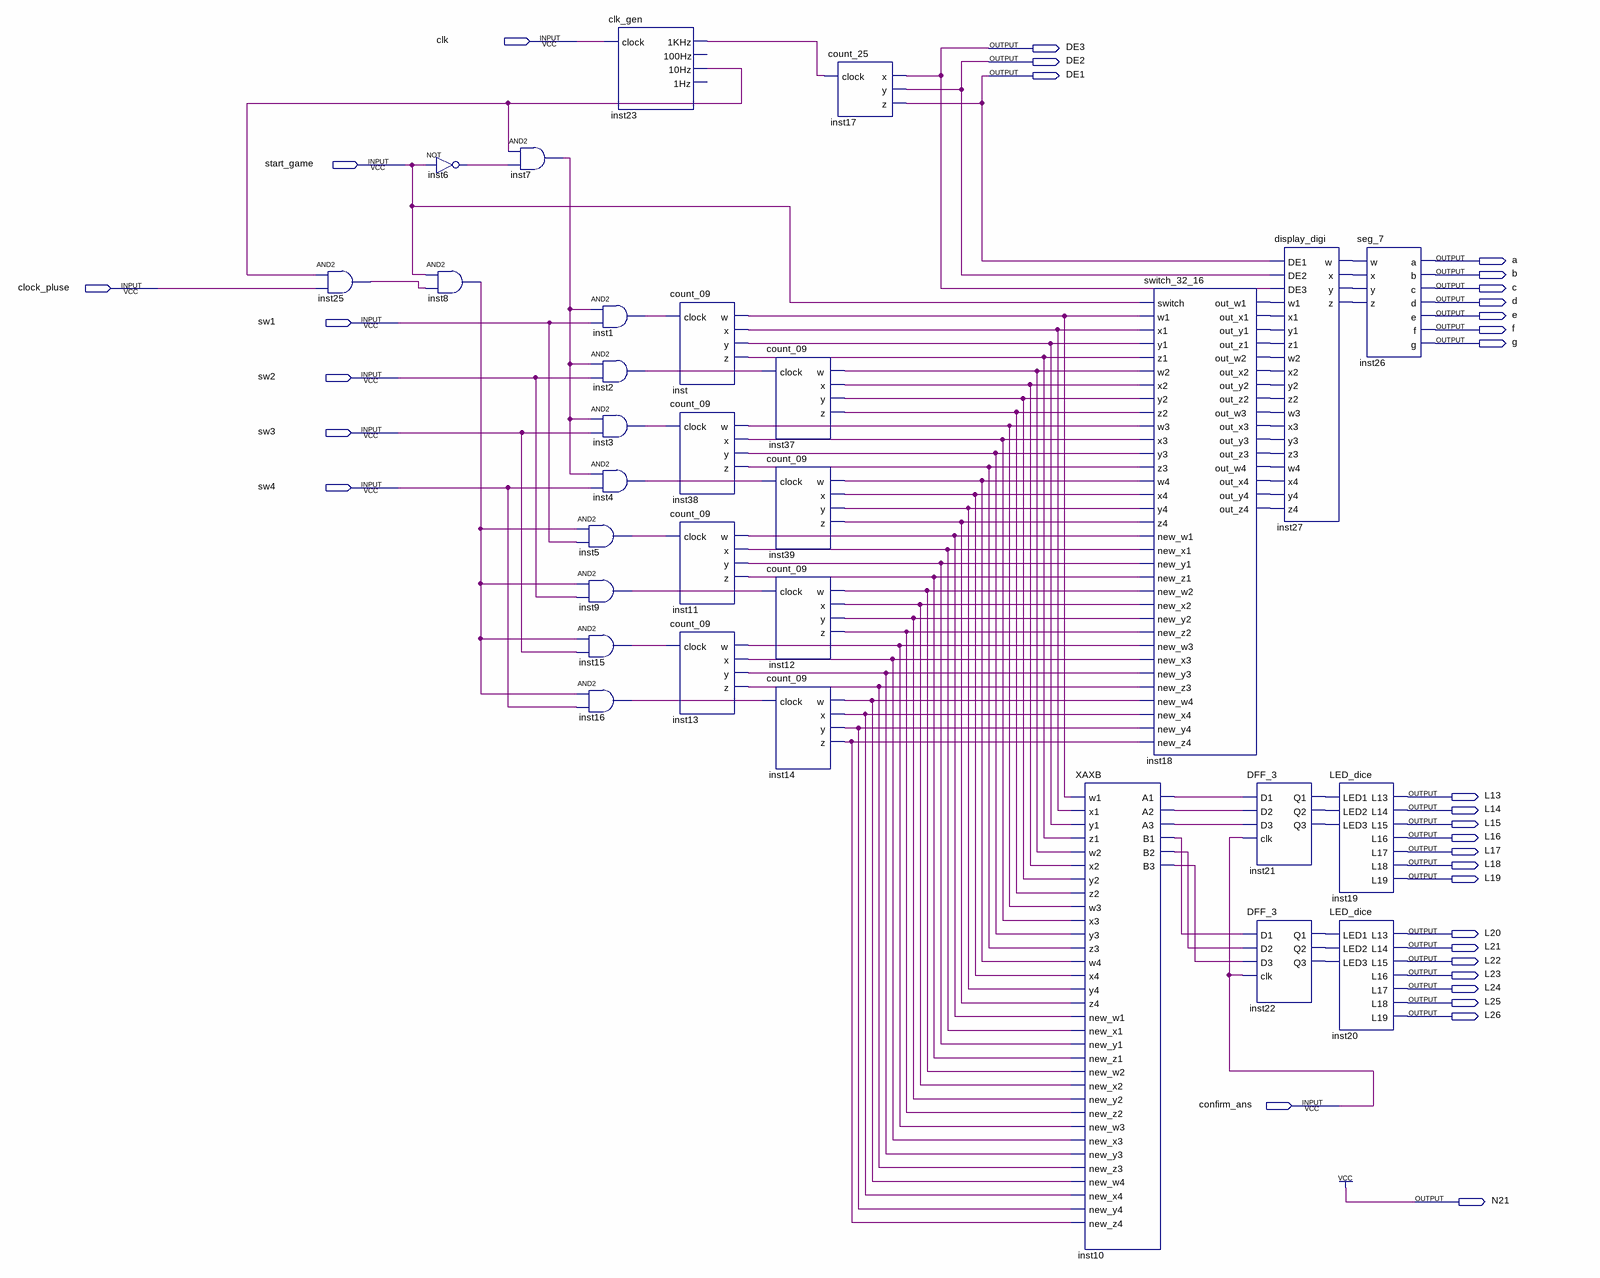
[diagram p0: schematic sheet]
// Quartus schematic test.bdf as structural Verilog: 30 symbols, 33 pins
module test (
  input  clk,
  input  start_game,
  input  clock_pluse,
  input  sw1,
  input  sw2,
  input  sw3,
  input  sw4,
  input  confirm_ans,
  output DE3,
  output DE2,
  output DE1,
  output a,
  output b,
  output c,
  output d,
  output e,
  output f,
  output g,
  output L13,
  output L14,
  output L15,
  output L16,
  output L17,
  output L18,
  output L19,
  output L20,
  output L21,
  output L22,
  output L23,
  output L24,
  output L25,
  output L26,
  output N21
);

  wire inst1_out, inst2_out, inst3_out, inst4_out, inst5_out, inst6_out, inst7_out, inst8_out, inst9_out,
       inst10_a1, inst10_a2, inst10_a3, inst10_b1, inst10_b2, inst10_b3, inst11_w, inst11_x, inst11_y,
       inst11_z, inst12_w, inst12_x, inst12_y, inst12_z, inst13_w, inst13_x, inst13_y, inst13_z, inst14_w,
       inst14_x, inst14_y, inst14_z, inst15_out, inst16_out, inst18_out_w1, inst18_out_w2, inst18_out_w3,
       inst18_out_w4, inst18_out_x1, inst18_out_x2, inst18_out_x3, inst18_out_x4, inst18_out_y1,
       inst18_out_y2, inst18_out_y3, inst18_out_y4, inst18_out_z1, inst18_out_z2, inst18_out_z3,
       inst18_out_z4, inst21_q1, inst21_q2, inst21_q3, inst22_q1, inst22_q2, inst22_q3, inst23_1khz,
       inst23_10hz, inst25_out, inst27_w, inst27_x, inst27_y, inst27_z, inst37_w, inst37_x, inst37_y,
       inst37_z, inst38_w, inst38_x, inst38_y, inst38_z, inst39_w, inst39_x, inst39_y, inst39_z, inst_w,
       inst_x, inst_y, inst_z;

  and inst25 (inst25_out, inst23_10hz, clock_pluse);
  not inst6 (inst6_out, start_game);
  and inst8 (inst8_out, start_game, inst25_out);
  and inst7 (inst7_out, inst23_10hz, inst6_out);
  clk_gen inst23 (.clock(clk), .\1KHz (inst23_1khz), .\10Hz (inst23_10hz));  // open: 100Hz, 1Hz
  and inst1 (inst1_out, inst7_out, sw1);
  and inst2 (inst2_out, inst7_out, sw2);
  and inst3 (inst3_out, inst7_out, sw3);
  and inst4 (inst4_out, inst7_out, sw4);
  and inst5 (inst5_out, inst8_out, sw1);
  and inst9 (inst9_out, inst8_out, sw2);
  and inst15 (inst15_out, inst8_out, sw3);
  and inst16 (inst16_out, inst8_out, sw4);
  count_09 inst (.clock(inst1_out), .w(inst_w), .x(inst_x), .y(inst_y), .z(inst_z));
  count_09 inst38 (.clock(inst3_out), .w(inst38_w), .x(inst38_x), .y(inst38_y), .z(inst38_z));
  count_09 inst11 (.clock(inst5_out), .w(inst11_w), .x(inst11_x), .y(inst11_y), .z(inst11_z));
  count_09 inst13 (.clock(inst15_out), .w(inst13_w), .x(inst13_x), .y(inst13_y), .z(inst13_z));
  count_09 inst37 (.clock(inst2_out), .w(inst37_w), .x(inst37_x), .y(inst37_y), .z(inst37_z));
  count_09 inst39 (.clock(inst4_out), .w(inst39_w), .x(inst39_x), .y(inst39_y), .z(inst39_z));
  count_09 inst12 (.clock(inst9_out), .w(inst12_w), .x(inst12_x), .y(inst12_y), .z(inst12_z));
  count_09 inst14 (.clock(inst16_out), .w(inst14_w), .x(inst14_x), .y(inst14_y), .z(inst14_z));
  count_25 inst17 (.clock(inst23_1khz), .x(DE3), .y(DE2), .z(DE1));
  XAXB inst10 (
    .w1(inst_w), .x1(inst_x), .y1(inst_y), .z1(inst_z), .w2(inst37_w), .x2(inst37_x), .y2(inst37_y),
    .z2(inst37_z), .w3(inst38_w), .x3(inst38_x), .y3(inst38_y), .z3(inst38_z), .w4(inst39_w), .x4(inst39_x),
    .y4(inst39_y), .z4(inst39_z), .new_w1(inst11_w), .new_x1(inst11_x), .new_y1(inst11_y), .new_z1(inst11_z),
    .new_w2(inst12_w), .new_x2(inst12_x), .new_y2(inst12_y), .new_z2(inst12_z), .new_w3(inst13_w),
    .new_x3(inst13_x), .new_y3(inst13_y), .new_z3(inst13_z), .new_w4(inst14_w), .new_x4(inst14_x),
    .new_y4(inst14_y), .new_z4(inst14_z), .A1(inst10_a1), .A2(inst10_a2), .A3(inst10_a3), .B1(inst10_b1),
    .B2(inst10_b2), .B3(inst10_b3));
  switch_32_16 inst18 (
    .switch(start_game), .w1(inst_w), .x1(inst_x), .y1(inst_y), .z1(inst_z), .w2(inst37_w), .x2(inst37_x),
    .y2(inst37_y), .z2(inst37_z), .w3(inst38_w), .x3(inst38_x), .y3(inst38_y), .z3(inst38_z), .w4(inst39_w),
    .x4(inst39_x), .y4(inst39_y), .z4(inst39_z), .new_w1(inst11_w), .new_x1(inst11_x), .new_y1(inst11_y),
    .new_z1(inst11_z), .new_w2(inst12_w), .new_x2(inst12_x), .new_y2(inst12_y), .new_z2(inst12_z),
    .new_w3(inst13_w), .new_x3(inst13_x), .new_y3(inst13_y), .new_z3(inst13_z), .new_w4(inst14_w),
    .new_x4(inst14_x), .new_y4(inst14_y), .new_z4(inst14_z), .out_w1(inst18_out_w1), .out_x1(inst18_out_x1),
    .out_y1(inst18_out_y1), .out_z1(inst18_out_z1), .out_w2(inst18_out_w2), .out_x2(inst18_out_x2),
    .out_y2(inst18_out_y2), .out_z2(inst18_out_z2), .out_w3(inst18_out_w3), .out_x3(inst18_out_x3),
    .out_y3(inst18_out_y3), .out_z3(inst18_out_z3), .out_w4(inst18_out_w4), .out_x4(inst18_out_x4),
    .out_y4(inst18_out_y4), .out_z4(inst18_out_z4));
  display_digi inst27 (
    .DE1(DE1), .DE2(DE2), .DE3(DE3), .w1(inst18_out_w1), .x1(inst18_out_x1), .y1(inst18_out_y1),
    .z1(inst18_out_z1), .w2(inst18_out_w2), .x2(inst18_out_x2), .y2(inst18_out_y2), .z2(inst18_out_z2),
    .w3(inst18_out_w3), .x3(inst18_out_x3), .y3(inst18_out_y3), .z3(inst18_out_z3), .w4(inst18_out_w4),
    .x4(inst18_out_x4), .y4(inst18_out_y4), .z4(inst18_out_z4), .w(inst27_w), .x(inst27_x), .y(inst27_y),
    .z(inst27_z));
  DFF_3 inst21 (
    .D1(inst10_a1), .D2(inst10_a2), .D3(inst10_a3), .clk(confirm_ans), .Q1(inst21_q1), .Q2(inst21_q2),
    .Q3(inst21_q3));
  DFF_3 inst22 (
    .D1(inst10_b1), .D2(inst10_b2), .D3(inst10_b3), .clk(confirm_ans), .Q1(inst22_q1), .Q2(inst22_q2),
    .Q3(inst22_q3));
  LED_dice inst19 (
    .LED1(inst21_q1), .LED2(inst21_q2), .LED3(inst21_q3), .L13(L13), .L14(L14), .L15(L15), .L16(L16),
    .L17(L17), .L18(L18), .L19(L19));
  LED_dice inst20 (
    .LED1(inst22_q1), .LED2(inst22_q2), .LED3(inst22_q3), .L13(L20), .L14(L21), .L15(L22), .L16(L23),
    .L17(L24), .L18(L25), .L19(L26));
  seg_7 inst26 (
    .w(inst27_w), .x(inst27_x), .y(inst27_y), .z(inst27_z), .a(a), .b(b), .c(c), .d(d), .e(e), .f(f), .g(g));

  assign N21 = 1'b1;
endmodule
